# Altium schematic sheet Amplifier_Filter_System.SchDoc
size A
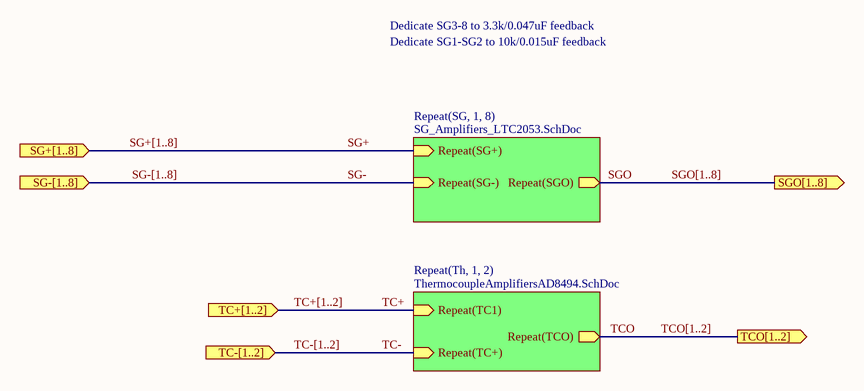
[diagram p0: Amplifier_Filter_System.SchDoc]

## Sub-sheets
Repeat(SG, 1, 8) = SG_Amplifiers_LTC2053.SchDoc: Repeat(SG+) (in), Repeat(SG-) (in), Repeat(SGO) (out)
Repeat(Th, 1, 2) = ThermocoupleAmplifiersAD8494.SchDoc: Repeat(TC1) (in), Repeat(TC+) (in), Repeat(TCO) (out)

## Ports
SG+[1..8] (in), SG-[1..8] (in), SGO[1..8] (out), TC+[1..2] (in), TC-[1..2] (in), TCO[1..2] (out)

## Nets
SG+: sheet Repeat(SG, 1, 8)/Repeat(SG+)
SG-: sheet Repeat(SG, 1, 8)/Repeat(SG-)
SGO: sheet Repeat(SG, 1, 8)/Repeat(SGO)
TC+: sheet Repeat(Th, 1, 2)/Repeat(TC1)
TC-: sheet Repeat(Th, 1, 2)/Repeat(TC+)
TCO: sheet Repeat(Th, 1, 2)/Repeat(TCO)

## Buses and harness runs
bus SG+[1..8] = port SG+[1..8]
bus SG-[1..8] = port SG-[1..8]
bus SGO[1..8] = port SGO[1..8]
bus TC+[1..2] = port TC+[1..2]
bus TC-[1..2] = port TC-[1..2]
bus TCO[1..2] = port TCO[1..2]

## Notes on the sheet
- Dedicate SG3-8 to 3.3k/0.047uF feedback
- Dedicate SG1-SG2 to 10k/0.015uF feedback